# EAGLE schematic Schema (EAGLE 9.6.2)
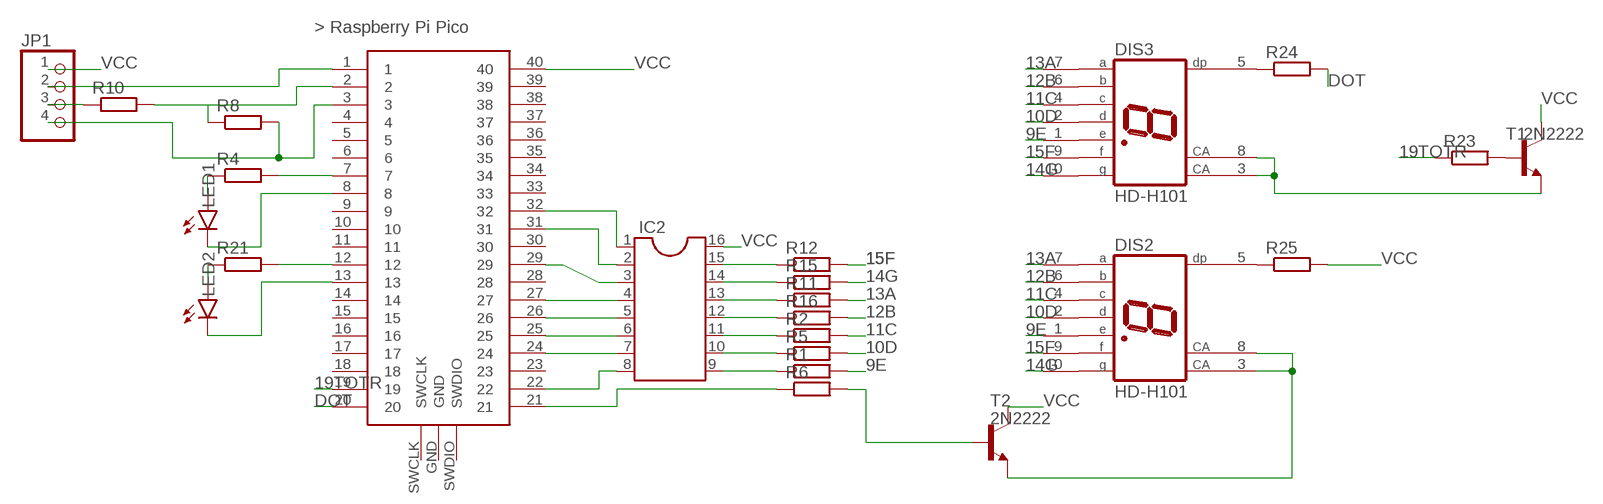
[diagram p0: schematic, sheet 1]

## Parts
DIS2  HD-H101  [HDSP-M]
DIS3  HD-H101  [HDSP-M]
IC2  DIL16  [DIL16]
JP1  PINHD-1X4  [1X04]
LED1  LED5MM  [LED5MM]
LED2  LED5MM  [LED5MM]
R1  R-EU_0207/10  [0207/10]
R2  R-EU_0207/10  [0207/10]
R4  R-EU_0207/10  [0207/10]
R5  R-EU_0207/10  [0207/10]
R6  R-EU_0207/10  [0207/10]
R8  R-EU_0207/10  [0207/10]
R10  R-EU_0207/10  [0207/10]
R11  R-EU_0207/10  [0207/10]
R12  R-EU_0207/10  [0207/10]
R15  R-EU_0207/10  [0207/10]
R16  R-EU_0207/10  [0207/10]
R21  R-EU_0207/10  [0207/10]
R23  R-EU_0207/10  [0207/10]
R24  R-EU_0207/10  [0207/10]
R25  R-EU_0207/10  [0207/10]
T1  2N2222  [TO18]
T2  2N2222  [TO18]
U$1  RASPBERRY-PI-PICO_TH  [FT_RASPBERRY-PI-PICO_TH]

## Nets
9E: DIS2.1(E) DIS3.1(E) R1.2
10D: DIS2.2(D) DIS3.2(D) R5.2
11C: DIS2.4(C) DIS3.4(C) R2.2
12B: DIS2.6(B) DIS3.6(B) R16.2
13A: DIS2.7(A) DIS3.7(A) R11.2
14G: DIS2.10(G) DIS3.10(G) R15.2
15F: DIS2.9(F) DIS3.9(F) R12.2
19TOTR: R23.1 U$1.19
DOT: R24.2 U$1.20
N$1: IC2.8 U$1.22
N$2: JP1.4 R8.2 U$1.3
N$3: R8.1 R10.2 U$1.2
N$4: JP1.2 U$1.1
N$5: JP1.3 R10.1
N$6: R4.2 U$1.7
N$7: LED1.A R4.1
N$8: LED1.K(C) U$1.8
N$9: IC2.1 U$1.32
N$10: IC2.2 U$1.31
N$11: IC2.7 U$1.24
N$12: IC2.6 U$1.25
N$13: IC2.5 U$1.26
N$14: IC2.4 U$1.27
N$15: IC2.3 U$1.29
N$16: IC2.15 R12.1
N$17: IC2.14 R15.1
N$18: R6.1 U$1.21
N$19: IC2.13 R11.1
N$20: IC2.12 R16.1
N$21: IC2.11 R2.1
N$22: IC2.10 R5.1
N$23: IC2.9 R1.1
N$24: R23.2 T1.2(B)
N$25: DIS3.3(CA) DIS3.8(CA) T1.1(E)
N$26: R21.2 U$1.12
N$27: LED2.A R21.1
N$28: LED2.K(C) U$1.13
N$29: DIS2.3(CA) DIS2.8(CA) T2.1(E)
N$30: R6.2 T2.2(B)
N$31: DIS2.5(DP) R25.1
N$33: DIS3.5(DP) R24.1
VCC: IC2.16 JP1.1 R25.2 T1.3(C) T2.3(C) U$1.40
Unconnected: U$1.4 U$1.5 U$1.6 U$1.9 U$1.10 U$1.11 U$1.14 U$1.15 U$1.16 U$1.17 U$1.18 U$1.23 U$1.28 U$1.30 U$1.33 U$1.34 U$1.35 U$1.36 U$1.37 U$1.38 U$1.39 U$1.GND U$1.SWCLK U$1.SWDIO

## Library data of the parts
DIS2 DIS3 = display-hp:HD-H101: LED DISPLAY 1-character 7 segment, decimal point right; OC_FARNELL: unknown; OC_NEWARK: unknown
IC2 = ic-package:DIL16: Dual In Line / Socket
JP1 = pinhead:PINHD-1X4: PIN HEADER
LED1 LED2 = led:LED: LED OSRAM: - CHIPLED LG R971, LG N971, LY N971, LG Q971, LY Q971, LO R971, LY R971 LH N974, LH R974 LS Q976, LO Q976, LY Q976 LO Q996 - Hyper CHIPLED LW Q18S LB Q993, LB Q99A, LB R99A - SideLED LS A670, LO A670, LY A670, LG A670, LP A670 LB A673, LV A673, LT A673, LW A673 LH A674 LY A675 LS A676, LA A676, LO A676, LY A676, LW A676 LS A679, LY A679, LG A679 - Hyper Micro SIDELED® LS Y876, LA Y876, LO Y876, LY Y876 LT Y87S - SmartLED LW L88C, LW L88S LB L89C, LB L89S, LG L890 LS L89K, LO L89K, LY L89K LS L896, LA L896, LO L896, LY L896 - TOPLED LS T670, LO T670, LY T670, LG T670, LP T670 LSG T670, LSP T670, LSY T670, LOP T670, LYG T670 LG T671, LOG T671, LSG T671 LB T673, LV T673, LT T673, LW T673 LH T674 LS T676, LA T676, LO T676, LY T676, LB T676, LH T676, LSB T676, LW T676 LB T67C, LV T67C, LT T67C, LS T67K, LO T67K, LY T67K, LW E67C LS E67B, LA E67B, LO E67B, LY E67B, LB E67C, LV E67C, LT E67C LW T67C LS T679, LY T679, LG T679 LS T770, LO T770, LY T770, LG T770, LP T770 LB T773, LV T773, LT T773, LW T773 LH T774 LS E675, LA E675, LY E675, LS T675 LS T776, LA T776, LO T776, LY T776, LB T776 LHGB T686 LT T68C, LB T68C - Hyper Mini TOPLED® LB M676 - Mini TOPLED Santana® LG M470 LS M47K, LO M47K, LY M47K Source: http://www.osram.convergy.de LUXEON: - LUMILED® LXK2-PW12-R00, LXK2-PW12-S00, LXK2-PW14-U00, LXK2-PW14-V00 LXK2-PM12-R00, LXK2-PM12-S00, LXK2-PM14-U00 LXK2-PE12-Q00, LXK2-PE12-R00, LXK2-PE12-S00, LXK2-PE14-T00, LXK2-PE14-U00 LXK2-PB12-K00, LXK2-PB12-L00, LXK2-PB12-M00, LXK2-PB14-N00, LXK2-PB14-P00, LXK2-PB14-Q00 LXK2-PR12-L00, LXK2-PR12-M00, LXK2-PR14-Q00, LXK2-PR14-R00 LXK2-PD12-Q00, LXK2-PD12-R00, LXK2-PD12-S00 LXK2-PH12-R00, LXK2-PH12-S00 LXK2-PL12-P00, LXK2-PL12-Q00, LXK2-PL12-R00 Source: www.luxeon.com KINGBRIGHT: KA-3528ASYC Source: www.kingbright.com
R1 R2 R4-R6 R8 R10-R12 R15 R16 R21 R23-R25 = rcl:R-EU_: RESISTOR, European symbol; SPICEPREFIX: R
T1 T2 = transistor:2N2222: NPN TRANSISTOR
U$1 = pipico:RASPBERRY-PI-PICO_TH: Raspberry Pi Pico microcontroller board for through-hole mounting.